# Altium schematic sheet ZYNQ_DDR3_Bank_502.SchDoc
size A4; DocumentNumber: 10; SheetNumber: 10; SheetTotal: 47
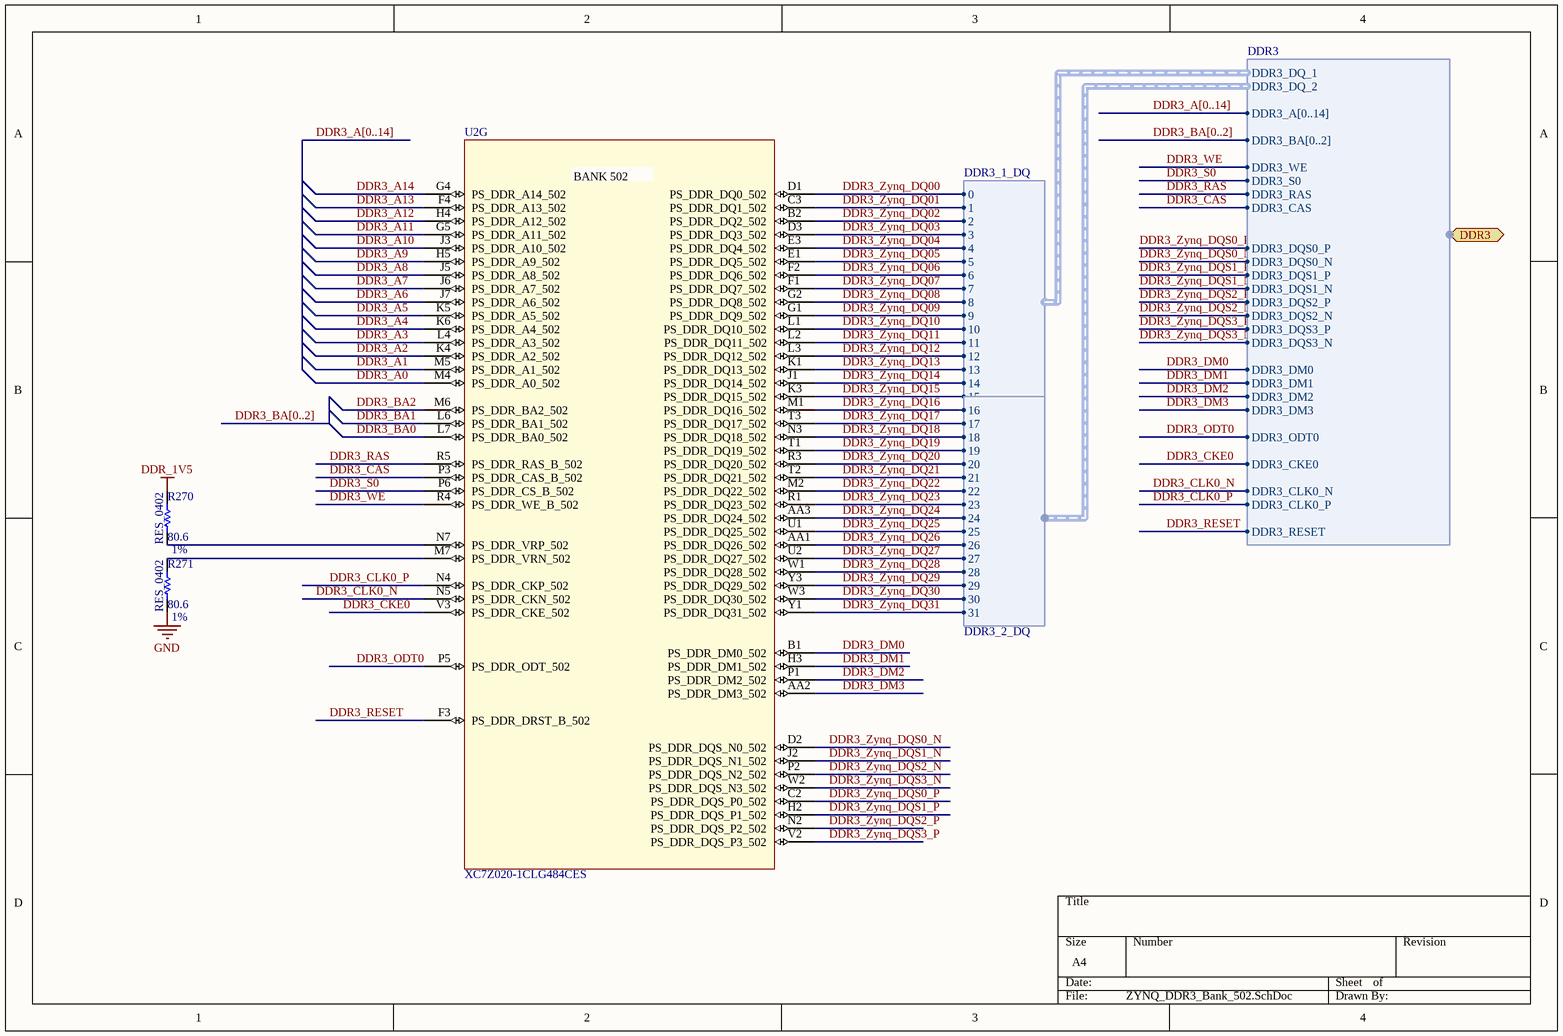
[diagram p0: ZYNQ_DDR3_Bank_502.SchDoc]

## Parts
R270  RES_0402  value 80.6  Tolerance: 1%  [RESC0402(1005)_N]
R271  RES_0402  value 80.6  Tolerance: 1%  [RESC0402(1005)_N]
U2  XC7Z020-1CLG484CES  [ZYNQ_xc7z020clg484pkg_BGA-484]  (part G of 10)

## Ports
DDR3 (harness DDR3)

## Harnesses
DDR3: DDR3_DQ_1, DDR3_DQ_2, DDR3_A[0..14], DDR3_BA[0..2], DDR3_WE, DDR3_S0, DDR3_RAS, DDR3_CAS, DDR3_DQS0_P, DDR3_DQS0_N, DDR3_DQS1_P, DDR3_DQS1_N, DDR3_DQS2_P, DDR3_DQS2_N, DDR3_DQS3_P, DDR3_DQS3_N, DDR3_DM0, DDR3_DM1, DDR3_DM2, DDR3_DM3, DDR3_ODT0, DDR3_CKE0, DDR3_CLK0_N, DDR3_CLK0_P, DDR3_RESET
DDR3_1_DQ: 0, 1, 2, 3, 4, 5, 6, 7, 8, 9, 10, 11, 12, 13, 14, 15
DDR3_2_DQ: 16, 17, 18, 19, 20, 21, 22, 23, 24, 25, 26, 27, 28, 29, 30, 31

## Nets
DDR_1V5: R270.2
GND: R271.1
DDR3_A0: U2.M4(PS_DDR_A0_502)
DDR3_A1: U2.M5(PS_DDR_A1_502)
DDR3_A2: U2.K4(PS_DDR_A2_502)
DDR3_A3: U2.L4(PS_DDR_A3_502)
DDR3_A4: U2.K6(PS_DDR_A4_502)
DDR3_A5: U2.K5(PS_DDR_A5_502)
DDR3_A6: U2.J7(PS_DDR_A6_502)
DDR3_A7: U2.J6(PS_DDR_A7_502)
DDR3_A8: U2.J5(PS_DDR_A8_502)
DDR3_A9: U2.H5(PS_DDR_A9_502)
DDR3_A10: U2.J3(PS_DDR_A10_502)
DDR3_A11: U2.G5(PS_DDR_A11_502)
DDR3_A12: U2.H4(PS_DDR_A12_502)
DDR3_A13: U2.F4(PS_DDR_A13_502)
DDR3_A14: U2.G4(PS_DDR_A14_502)
DDR3_BA0: U2.L7(PS_DDR_BA0_502)
DDR3_BA1: U2.L6(PS_DDR_BA1_502)
DDR3_BA2: U2.M6(PS_DDR_BA2_502)
DDR3_CAS: U2.P3(PS_DDR_CAS_B_502) ; port DDR3.DDR3_CAS
DDR3_CKE0: U2.V3(PS_DDR_CKE_502) ; port DDR3.DDR3_CKE0
DDR3_CLK0_N: U2.N5(PS_DDR_CKN_502) ; port DDR3.DDR3_CLK0_N
DDR3_CLK0_P: U2.N4(PS_DDR_CKP_502) ; port DDR3.DDR3_CLK0_P
DDR3_DM0: U2.B1(PS_DDR_DM0_502) ; port DDR3.DDR3_DM0
DDR3_DM1: U2.H3(PS_DDR_DM1_502) ; port DDR3.DDR3_DM1
DDR3_DM2: U2.P1(PS_DDR_DM2_502) ; port DDR3.DDR3_DM2
DDR3_DM3: U2.AA2(PS_DDR_DM3_502) ; port DDR3.DDR3_DM3
DDR3_ODT0: U2.P5(PS_DDR_ODT_502) ; port DDR3.DDR3_ODT0
DDR3_RAS: U2.R5(PS_DDR_RAS_B_502) ; port DDR3.DDR3_RAS
DDR3_RESET: U2.F3(PS_DDR_DRST_B_502) ; port DDR3.DDR3_RESET
DDR3_S0: U2.P6(PS_DDR_CS_B_502) ; port DDR3.DDR3_S0
DDR3_WE: U2.R4(PS_DDR_WE_B_502) ; port DDR3.DDR3_WE
DDR3_Zynq_DQ00: U2.D1(PS_DDR_DQ0_502) ; harness DDR3_1_DQ.0
DDR3_Zynq_DQ01: U2.C3(PS_DDR_DQ1_502) ; harness DDR3_1_DQ.1
DDR3_Zynq_DQ02: U2.B2(PS_DDR_DQ2_502) ; harness DDR3_1_DQ.2
DDR3_Zynq_DQ03: U2.D3(PS_DDR_DQ3_502) ; harness DDR3_1_DQ.3
DDR3_Zynq_DQ04: U2.E3(PS_DDR_DQ4_502) ; harness DDR3_1_DQ.4
DDR3_Zynq_DQ05: U2.E1(PS_DDR_DQ5_502) ; harness DDR3_1_DQ.5
DDR3_Zynq_DQ06: U2.F2(PS_DDR_DQ6_502) ; harness DDR3_1_DQ.6
DDR3_Zynq_DQ07: U2.F1(PS_DDR_DQ7_502) ; harness DDR3_1_DQ.7
DDR3_Zynq_DQ08: U2.G2(PS_DDR_DQ8_502) ; harness DDR3_1_DQ.8
DDR3_Zynq_DQ09: U2.G1(PS_DDR_DQ9_502) ; harness DDR3_1_DQ.9
DDR3_Zynq_DQ10: U2.L1(PS_DDR_DQ10_502) ; harness DDR3_1_DQ.10
DDR3_Zynq_DQ11: U2.L2(PS_DDR_DQ11_502) ; harness DDR3_1_DQ.11
DDR3_Zynq_DQ12: U2.L3(PS_DDR_DQ12_502) ; harness DDR3_1_DQ.12
DDR3_Zynq_DQ13: U2.K1(PS_DDR_DQ13_502) ; harness DDR3_1_DQ.13
DDR3_Zynq_DQ14: U2.J1(PS_DDR_DQ14_502) ; harness DDR3_1_DQ.14
DDR3_Zynq_DQ15: U2.K3(PS_DDR_DQ15_502) ; harness DDR3_1_DQ.15
DDR3_Zynq_DQ16: U2.M1(PS_DDR_DQ16_502) ; harness DDR3_2_DQ.16
DDR3_Zynq_DQ17: U2.T3(PS_DDR_DQ17_502) ; harness DDR3_2_DQ.17
DDR3_Zynq_DQ18: U2.N3(PS_DDR_DQ18_502) ; harness DDR3_2_DQ.18
DDR3_Zynq_DQ19: U2.T1(PS_DDR_DQ19_502) ; harness DDR3_2_DQ.19
DDR3_Zynq_DQ20: U2.R3(PS_DDR_DQ20_502) ; harness DDR3_2_DQ.20
DDR3_Zynq_DQ21: U2.T2(PS_DDR_DQ21_502) ; harness DDR3_2_DQ.21
DDR3_Zynq_DQ22: U2.M2(PS_DDR_DQ22_502) ; harness DDR3_2_DQ.22
DDR3_Zynq_DQ23: U2.R1(PS_DDR_DQ23_502) ; harness DDR3_2_DQ.23
DDR3_Zynq_DQ24: U2.AA3(PS_DDR_DQ24_502) ; harness DDR3_2_DQ.24
DDR3_Zynq_DQ25: U2.U1(PS_DDR_DQ25_502) ; harness DDR3_2_DQ.25
DDR3_Zynq_DQ26: U2.AA1(PS_DDR_DQ26_502) ; harness DDR3_2_DQ.26
DDR3_Zynq_DQ27: U2.U2(PS_DDR_DQ27_502) ; harness DDR3_2_DQ.27
DDR3_Zynq_DQ28: U2.W1(PS_DDR_DQ28_502) ; harness DDR3_2_DQ.28
DDR3_Zynq_DQ29: U2.Y3(PS_DDR_DQ29_502) ; harness DDR3_2_DQ.29
DDR3_Zynq_DQ30: U2.W3(PS_DDR_DQ30_502) ; harness DDR3_2_DQ.30
DDR3_Zynq_DQ31: U2.Y1(PS_DDR_DQ31_502) ; harness DDR3_2_DQ.31
DDR3_Zynq_DQS0_N: U2.D2(PS_DDR_DQS_N0_502) ; port DDR3.DDR3_DQS0_N
DDR3_Zynq_DQS0_P: U2.C2(PS_DDR_DQS_P0_502) ; port DDR3.DDR3_DQS0_P
DDR3_Zynq_DQS1_N: U2.J2(PS_DDR_DQS_N1_502) ; port DDR3.DDR3_DQS1_N
DDR3_Zynq_DQS1_P: U2.H2(PS_DDR_DQS_P1_502) ; port DDR3.DDR3_DQS1_P
DDR3_Zynq_DQS2_N: U2.P2(PS_DDR_DQS_N2_502) ; port DDR3.DDR3_DQS2_N
DDR3_Zynq_DQS2_P: U2.N2(PS_DDR_DQS_P2_502) ; port DDR3.DDR3_DQS2_P
DDR3_Zynq_DQS3_N: U2.W2(PS_DDR_DQS_N3_502) ; port DDR3.DDR3_DQS3_N
DDR3_Zynq_DQS3_P: U2.V2(PS_DDR_DQS_P3_502) ; port DDR3.DDR3_DQS3_P
NetR270_1: R270.1 U2.N7(PS_DDR_VRP_502)
NetR271_2: R271.2 U2.M7(PS_DDR_VRN_502)

## Buses and harness runs
bus DDR3_A[0..14]
bus DDR3_BA[0..2]

## Notes on the sheet
- (in symbol XC7Z020-1CLG484CES, part G) BANK 502

## Library data of the parts
R270 R271 = RMCF0402FT80R6: 80.6 ohm, 1% 1/16W, 0402; Manufacturer: Stackpole Electronics; Part Number: RMCF0402FT80R6; Footprint Ref: RESC0402(1005)_N; Library Ref: RES_0402
U2 = XC7Z020-1CLG484CES: XC7Z020-1CLG484CES, Zynq-7000 All Programmable SoC; Manufacturer: Xilinx; Part Number: XC7Z020-1CLG484CES